# Altium project Fuse.PRJPCB
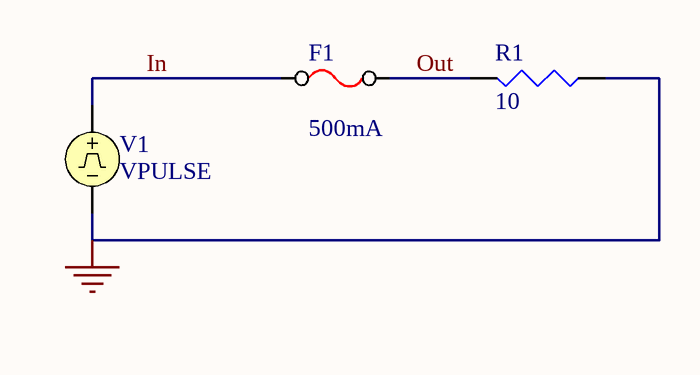
[diagram p0: Fuse.schdoc]
1 sheet, 3 parts. Net scope: global (net labels, ports and power ports of the same name join across sheets).

## Sheet Fuse.schdoc: Fuse
size A4; Organization: Altium Limited; Address1: L3, 12a Rodborough Rd; Address2: Frenchs Forest; Address3: NSW; Address4: Australia 2086; DocumentNumber: 1; SheetNumber: 1; SheetTotal: 1

### Parts
F1  500mA
R1  10
V1  VPULSE

### Nets
GND: R1.2(BOT) V1.2
In: F1.1 V1.1
Out: F1.2 R1.1(TOP)

### Notes on the sheet
- Title
- Size:
- Date:
- A4
- Number:
- Time:
- Revision:
- Sheet
- of
- File:

### Library data of the parts
F1 = FUSE: CURRENT: 500mA
R1 = RES: Resistor; Value: 10
V1 = VPULSE: Pulse Voltage Source